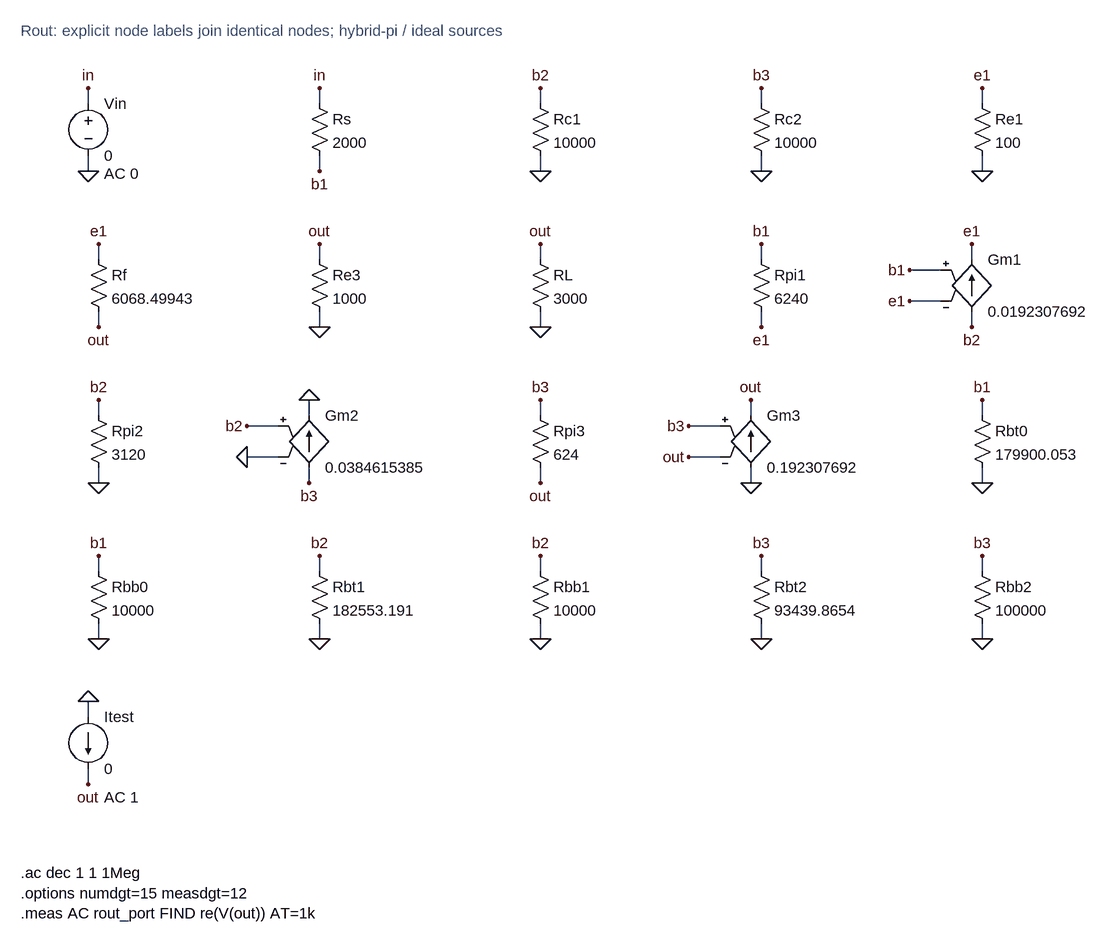
[diagram p0: schematic Rout.asc]
Rout.asc, the LTspice schematic file:
Version 4
SHEET 1 1800 1500
TEXT 16 -48 Left 2 ;Rout: explicit node labels join identical nodes; hybrid-pi / ideal sources
WIRE 120 64 120 40
FLAG 120 40 in
WIRE 120 144 120 168
FLAG 120 168 0
SYMBOL voltage 120 48 R0
SYMATTR InstName Vin
WINDOW 123 24 124 Left 2
SYMATTR Value 0
SYMATTR Value2 AC 0
WIRE 476 64 476 40
FLAG 476 40 in
WIRE 476 144 476 168
FLAG 476 168 b1
SYMBOL res 460 48 R0
SYMATTR InstName Rs
SYMATTR Value 2000
WIRE 816 64 816 40
FLAG 816 40 b2
WIRE 816 144 816 168
FLAG 816 168 0
SYMBOL res 800 48 R0
SYMATTR InstName Rc1
SYMATTR Value 10000
WIRE 1156 64 1156 40
FLAG 1156 40 b3
WIRE 1156 144 1156 168
FLAG 1156 168 0
SYMBOL res 1140 48 R0
SYMATTR InstName Rc2
SYMATTR Value 10000
WIRE 1496 64 1496 40
FLAG 1496 40 e1
WIRE 1496 144 1496 168
FLAG 1496 168 0
SYMBOL res 1480 48 R0
SYMATTR InstName Re1
SYMATTR Value 100
WIRE 136 304 136 280
FLAG 136 280 e1
WIRE 136 384 136 408
FLAG 136 408 out
SYMBOL res 120 288 R0
SYMATTR InstName Rf
SYMATTR Value 6068.49943
WIRE 476 304 476 280
FLAG 476 280 out
WIRE 476 384 476 408
FLAG 476 408 0
SYMBOL res 460 288 R0
SYMATTR InstName Re3
SYMATTR Value 1000
WIRE 816 304 816 280
FLAG 816 280 out
WIRE 816 384 816 408
FLAG 816 408 0
SYMBOL res 800 288 R0
SYMATTR InstName RL
SYMATTR Value 3000
WIRE 1156 304 1156 280
FLAG 1156 280 b1
WIRE 1156 384 1156 408
FLAG 1156 408 e1
SYMBOL res 1140 288 R0
SYMATTR InstName Rpi1
SYMATTR Value 6240
WIRE 1480 384 1480 408
FLAG 1480 408 b2
WIRE 1480 304 1480 280
FLAG 1480 280 e1
WIRE 1432 320 1384 320
FLAG 1384 320 b1
WIRE 1432 368 1384 368
FLAG 1384 368 e1
SYMBOL g 1480 288 R0
SYMATTR InstName Gm1
SYMATTR Value 0.0192307692
WIRE 136 544 136 520
FLAG 136 520 b2
WIRE 136 624 136 648
FLAG 136 648 0
SYMBOL res 120 528 R0
SYMATTR InstName Rpi2
SYMATTR Value 3120
WIRE 460 624 460 648
FLAG 460 648 b3
WIRE 460 544 460 520
FLAG 460 520 0
WIRE 412 560 364 560
FLAG 364 560 b2
WIRE 412 608 364 608
FLAG 364 608 0
SYMBOL g 460 528 R0
SYMATTR InstName Gm2
SYMATTR Value 0.0384615385
WIRE 816 544 816 520
FLAG 816 520 b3
WIRE 816 624 816 648
FLAG 816 648 out
SYMBOL res 800 528 R0
SYMATTR InstName Rpi3
SYMATTR Value 624
WIRE 1140 624 1140 648
FLAG 1140 648 0
WIRE 1140 544 1140 520
FLAG 1140 520 out
WIRE 1092 560 1044 560
FLAG 1044 560 b3
WIRE 1092 608 1044 608
FLAG 1044 608 out
SYMBOL g 1140 528 R0
SYMATTR InstName Gm3
SYMATTR Value 0.192307692
WIRE 1496 544 1496 520
FLAG 1496 520 b1
WIRE 1496 624 1496 648
FLAG 1496 648 0
SYMBOL res 1480 528 R0
SYMATTR InstName Rbt0
SYMATTR Value 179900.053
WIRE 136 784 136 760
FLAG 136 760 b1
WIRE 136 864 136 888
FLAG 136 888 0
SYMBOL res 120 768 R0
SYMATTR InstName Rbb0
SYMATTR Value 10000
WIRE 476 784 476 760
FLAG 476 760 b2
WIRE 476 864 476 888
FLAG 476 888 0
SYMBOL res 460 768 R0
SYMATTR InstName Rbt1
SYMATTR Value 182553.191
WIRE 816 784 816 760
FLAG 816 760 b2
WIRE 816 864 816 888
FLAG 816 888 0
SYMBOL res 800 768 R0
SYMATTR InstName Rbb1
SYMATTR Value 10000
WIRE 1156 784 1156 760
FLAG 1156 760 b3
WIRE 1156 864 1156 888
FLAG 1156 888 0
SYMBOL res 1140 768 R0
SYMATTR InstName Rbt2
SYMATTR Value 93439.8654
WIRE 1496 784 1496 760
FLAG 1496 760 b3
WIRE 1496 864 1496 888
FLAG 1496 888 0
SYMBOL res 1480 768 R0
SYMATTR InstName Rbb2
SYMATTR Value 100000
WIRE 120 1008 120 984
FLAG 120 984 0
WIRE 120 1088 120 1112
FLAG 120 1112 out
SYMBOL current 120 1008 R0
SYMATTR InstName Itest
WINDOW 123 24 124 Left 2
SYMATTR Value 0
SYMATTR Value2 AC 1
TEXT 16 1248 Left 2 !.ac dec 1 1 1Meg\n.options numdgt=15 measdgt=12\n.meas AC rout_port FIND re(V(out)) AT=1k

The netlist it stands for:
* Rout.asc
Vin in 0 0 AC 0
Rs in b1 2000
Rc1 b2 0 10000
Rc2 b3 0 10000
Re1 e1 0 100
Rf e1 out 6068.49943
Re3 out 0 1000
RL out 0 3000
Rpi1 b1 e1 6240
Gm1 b2 e1 b1 e1 0.0192307692
Rpi2 b2 0 3120
Gm2 b3 0 b2 0 0.0384615385
Rpi3 b3 out 624
Gm3 0 out b3 out 0.192307692
Rbt0 b1 0 179900.053
Rbb0 b1 0 10000
Rbt1 b2 0 182553.191
Rbb1 b2 0 10000
Rbt2 b3 0 93439.8654
Rbb2 b3 0 100000
Itest 0 out 0 AC 1
* Rout: explicit node labels join identical nodes; hybrid-pi / ideal sources
.ac dec 1 1 1Meg
.options numdgt=15 measdgt=12
.meas AC rout_port FIND re(V(out)) AT=1k
.backanno
.end

* Results of the author's LTspice run, read from the files saved beside the schematic
* From the log:
*   rout_port: re(V(out))=(1.68474366189dB,0°) at 1000